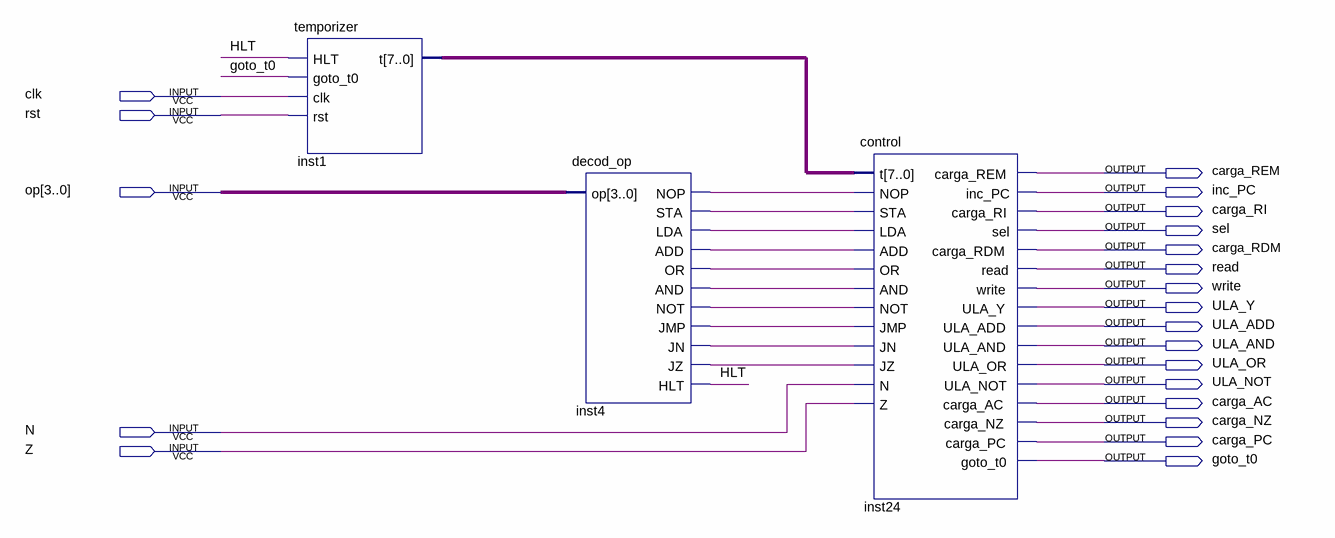
[diagram p0: schematic sheet]
// Quartus schematic control_test.bdf as structural Verilog: 3 symbols, 21 pins
module control_test (
  input  clk,
  input  rst,
  input  [3:0] op,
  input  N,
  input  Z,
  output carga_REM,
  output inc_PC,
  output carga_RI,
  output sel,
  output carga_RDM,
  output read,
  output write,
  output ULA_Y,
  output ULA_ADD,
  output ULA_AND,
  output ULA_OR,
  output ULA_NOT,
  output carga_AC,
  output carga_NZ,
  output carga_PC,
  output goto_t0
);

  wire HLT, inst4_add, inst4_and, inst4_jmp, inst4_jn, inst4_jz, inst4_lda, inst4_nop, inst4_not, inst4_or,
       inst4_sta;
  wire [7:0] inst1_t;

  temporizer inst1 (.HLT(HLT), .goto_t0(goto_t0), .clk(clk), .rst(rst), .t(inst1_t));
  decod_op inst4 (
    .op(op), .NOP(inst4_nop), .STA(inst4_sta), .LDA(inst4_lda), .ADD(inst4_add), .OR(inst4_or),
    .AND(inst4_and), .NOT(inst4_not), .JMP(inst4_jmp), .JN(inst4_jn), .JZ(inst4_jz), .HLT(HLT));
  control inst24 (
    .t(inst1_t), .NOP(inst4_nop), .STA(inst4_sta), .LDA(inst4_lda), .ADD(inst4_add), .OR(inst4_or),
    .AND(inst4_and), .NOT(inst4_not), .JMP(inst4_jmp), .JN(inst4_jn), .JZ(inst4_jz), .N(N), .Z(Z),
    .carga_REM(carga_REM), .inc_PC(inc_PC), .carga_RI(carga_RI), .sel(sel), .carga_RDM(carga_RDM),
    .read(read), .write(write), .ULA_Y(ULA_Y), .ULA_ADD(ULA_ADD), .ULA_AND(ULA_AND), .ULA_OR(ULA_OR),
    .ULA_NOT(ULA_NOT), .carga_AC(carga_AC), .carga_NZ(carga_NZ), .carga_PC(carga_PC), .goto_t0(goto_t0));
endmodule
